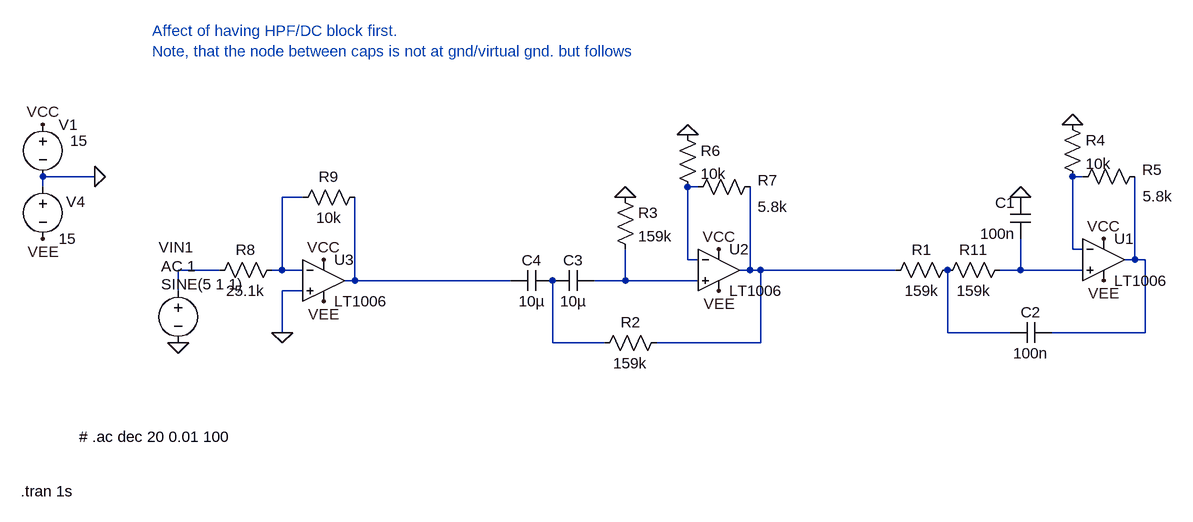
[diagram p0: schematic Draft09.asc]
Draft09.asc, the LTspice schematic file:
Version 4
SHEET 1 2756 2104
WIRE -672 -544 -752 -544
WIRE 848 -544 832 -544
WIRE -752 -528 -752 -544
WIRE 256 -528 240 -528
WIRE -352 -512 -384 -512
WIRE 832 -432 832 -544
WIRE 848 -432 832 -432
WIRE 240 -416 240 -528
WIRE 256 -416 240 -416
WIRE 928 -416 928 -544
WIRE 928 -416 912 -416
WIRE 944 -416 928 -416
WIRE -480 -400 -544 -400
WIRE -384 -400 -384 -512
WIRE -384 -400 -400 -400
WIRE -352 -400 -384 -400
WIRE 336 -400 336 -528
WIRE 336 -400 320 -400
WIRE 352 -400 336 -400
WIRE 560 -400 352 -400
WIRE 752 -400 752 -448
WIRE 752 -400 720 -400
WIRE 848 -400 752 -400
WIRE -272 -384 -272 -512
WIRE -272 -384 -288 -384
WIRE -32 -384 -272 -384
WIRE 144 -384 144 -432
WIRE 144 -384 96 -384
WIRE 256 -384 144 -384
WIRE -544 -368 -544 -400
WIRE -352 -368 -384 -368
WIRE -384 -304 -384 -368
WIRE 640 -304 640 -400
WIRE 736 -304 640 -304
WIRE 944 -304 944 -416
WIRE 944 -304 800 -304
WIRE 32 -288 32 -384
WIRE 112 -288 32 -288
WIRE 352 -288 352 -400
WIRE 352 -288 192 -288
FLAG -752 -624 VCC
FLAG -752 -448 VEE
FLAG 880 -448 VCC
FLAG 880 -384 VEE
FLAG -672 -544 0
FLAG 752 -512 0
FLAG -544 -288 0
FLAG 288 -432 VCC
FLAG 288 -368 VEE
FLAG 144 -512 0
FLAG 832 -624 0
FLAG 240 -608 0
FLAG -320 -416 VCC
FLAG -320 -352 VEE
FLAG -384 -304 0
SYMBOL voltage -752 -640 R0
WINDOW 123 0 0 Left 0
WINDOW 39 0 0 Left 0
WINDOW 3 42 41 Left 2
SYMATTR Value 15
SYMATTR InstName V1
SYMBOL voltage -752 -544 R0
WINDOW 123 0 0 Left 0
WINDOW 39 0 0 Left 0
WINDOW 0 36 39 Left 2
SYMATTR InstName V4
SYMATTR Value 15
SYMBOL res 624 -384 R270
WINDOW 0 32 56 VTop 2
WINDOW 3 0 56 VBottom 2
SYMATTR InstName R11
SYMATTR Value 159k
SYMBOL OpAmps\\LT1006 880 -480 R0
SYMATTR InstName U1
SYMBOL res 544 -384 R270
WINDOW 0 32 56 VTop 2
WINDOW 3 0 56 VBottom 2
SYMATTR InstName R1
SYMATTR Value 159k
SYMBOL cap 800 -320 R90
WINDOW 0 0 32 VBottom 2
WINDOW 3 32 32 VTop 2
SYMATTR InstName C2
SYMATTR Value 100n
SYMBOL cap 768 -448 R180
WINDOW 0 24 56 Left 2
WINDOW 3 24 8 Left 2
SYMATTR InstName C1
SYMATTR Value 100n
SYMBOL voltage -544 -384 R0
WINDOW 123 -26 -22 Left 2
WINDOW 39 0 0 Left 0
WINDOW 3 -26 6 Left 2
WINDOW 0 -30 -51 Left 2
SYMATTR Value2 AC 1
SYMATTR Value SINE(5 1 1)
SYMATTR InstName VIN1
SYMBOL res 96 -272 R270
WINDOW 0 32 56 VTop 2
WINDOW 3 0 56 VBottom 2
SYMATTR InstName R2
SYMATTR Value 159k
SYMBOL OpAmps\\LT1006 288 -464 R0
SYMATTR InstName U2
SYMBOL res 128 -528 R0
SYMATTR InstName R3
SYMATTR Value 159k
SYMBOL cap 32 -368 R270
WINDOW 0 32 32 VTop 2
WINDOW 3 0 32 VBottom 2
SYMATTR InstName C3
SYMATTR Value 10µ
SYMBOL cap -32 -368 R270
WINDOW 0 32 32 VTop 2
WINDOW 3 0 32 VBottom 2
SYMATTR InstName C4
SYMATTR Value 10µ
SYMBOL res 816 -640 R0
SYMATTR InstName R4
SYMATTR Value 10k
SYMBOL res 944 -560 R90
WINDOW 0 21 -11 VBottom 2
WINDOW 3 31 -19 VTop 2
SYMATTR InstName R5
SYMATTR Value 5.8k
SYMBOL res 224 -624 R0
SYMATTR InstName R6
SYMATTR Value 10k
SYMBOL res 352 -544 R90
WINDOW 0 21 -11 VBottom 2
WINDOW 3 31 -19 VTop 2
SYMATTR InstName R7
SYMATTR Value 5.8k
SYMBOL OpAmps\\LT1006 -320 -448 R0
SYMATTR InstName U3
SYMBOL res -496 -384 R270
WINDOW 0 32 56 VTop 2
WINDOW 3 0 56 VBottom 2
SYMATTR InstName R8
SYMATTR Value 25.1k
SYMBOL res -368 -496 R270
WINDOW 0 32 56 VTop 2
WINDOW 3 0 56 VBottom 2
SYMATTR InstName R9
SYMATTR Value 10k
TEXT -696 -144 Left 2 !# .ac dec 20 0.01 100
TEXT -786 -60 Left 2 !.tran 1s
TEXT -584 -768 Left 2 ;Affect of having HPF/DC block first.\nNote, that the node between caps is not at gnd/virtual gnd. but follows

The netlist it stands for:
* Draft09.asc
V1 VCC 0 15
V4 0 VEE 15
R11 N010 N007 159k
XU1 N007 N001 VCC VEE N004 LT1006  ; pins In+ In- V+ V- OUT
R1 N006 N010 159k
C2 N004 N010 100n
C1 N007 0 100n
VIN1 N005 0 SINE(5 1 1) AC 1
R2 N011 N006 159k
XU2 N009 N002 VCC VEE N006 LT1006  ; pins In+ In- V+ V- OUT
R3 0 N009 159k
C3 N011 N009 10µ
C4 N008 N011 10µ
R4 0 N001 10k
R5 N004 N001 5.8k
R6 0 N002 10k
R7 N006 N002 5.8k
XU3 0 N003 VCC VEE N008 LT1006  ; pins In+ In- V+ V- OUT
R8 N005 N003 25.1k
R9 N003 N008 10k
# .ac dec 20 0.01 100
.tran 1s
* Affect of having HPF/DC block first.
* Note, that the node between caps is not at gnd/virtual gnd. but follows
.lib LTC.lib
.backanno
.end